# Altium project LIS2DE12TR.PrjPcb
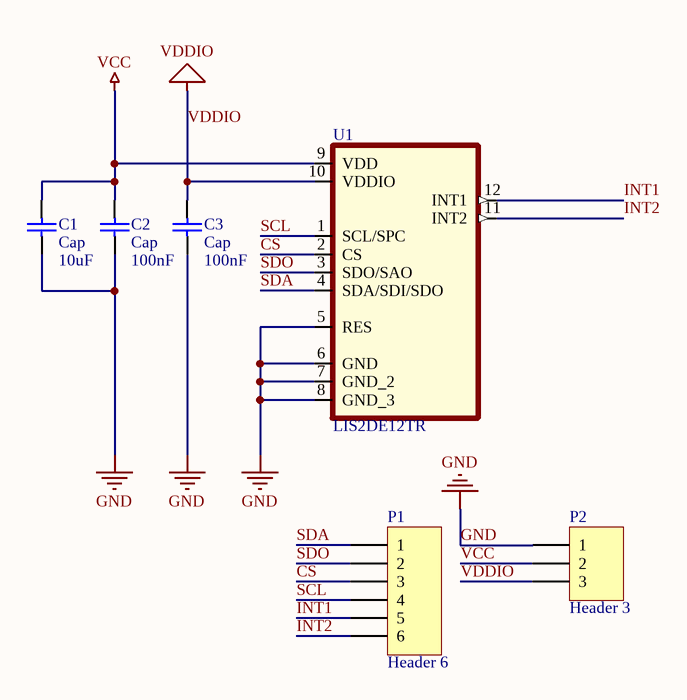
[diagram p0: LIS2DE12TR.SchDoc]
1 sheet, 6 parts. Net scope: global (net labels, ports and power ports of the same name join across sheets).
Board file: LIS2DE12TR.PcbDoc

## Sheet LIS2DE12TR.SchDoc: Evaluation Board LIS2DE12TR
size A4; Date: 07/12/2016; CheckedBy: Nicolas LAW; Author: Nicolas LAW; DrawnBy: Nicolas LAW; Engineer: Nicolas LAW; Revision: 1; SheetNumber: 1; SheetTotal: 1; DocumentName: Evaluation Board LIS2DE12TR; ProjectName: Knocklet

### Parts
C1  Cap  value 10uF  [capacitor_10uf]
C2  Cap  value 100nF  [capacitor_10uf]
C3  Cap  value 100nF  [capacitor_10uf]
P1  Header 6  [HDR1X6]
P2  Header 3  [HDR1X3]
U1  LIS2DE12TR  [LIS2DE12TR]

### Nets
GND: C1.1 C2.1 C3.1 P2.1 U1.5(RES) U1.6(GND) U1.7(GND_2) U1.8(GND_3)
VCC: C1.2 C2.2 P2.2 U1.9(VDD)
VDDIO: C3.2 P2.3 U1.10(VDDIO)
CS: P1.3 U1.2(CS)
INT1: P1.5 U1.12(INT1)
INT2: P1.6 U1.11(INT2)
SCL: P1.4 U1.1(SCL/SPC)
SDA: P1.1 U1.4(SDA/SDI/SDO)
SDO: P1.2 U1.3(SDO/SAO)

### Notes on the sheet
- Title
- Size:
- Date:
- A4
- Number:
- Time:
- Revision:
- Sheet
- of
- File:

### Library data of the parts
C1-C3 = Cap: Capacitor; Published: 8-Jun-2000; LatestRevisionDate: 17-Jul-2002; LatestRevisionNote: Re-released for DXP Platform.; PackageReference: RAD-0.3; Publisher: Altium Limited; PackageDescription: Radial Cap, Thru-Hole; 2 Leads; 0.3 in Pin Spacing
P1 = Header 6: Header, 6-Pin; LatestRevisionDate: 17-Jul-2002; LatestRevisionNote: Re-released for DXP Platform.; Publisher: Altium Limited
P2 = Header 3: Header, 3-Pin; LatestRevisionDate: 17-Jul-2002; LatestRevisionNote: Re-released for DXP Platform.; Publisher: Altium Limited